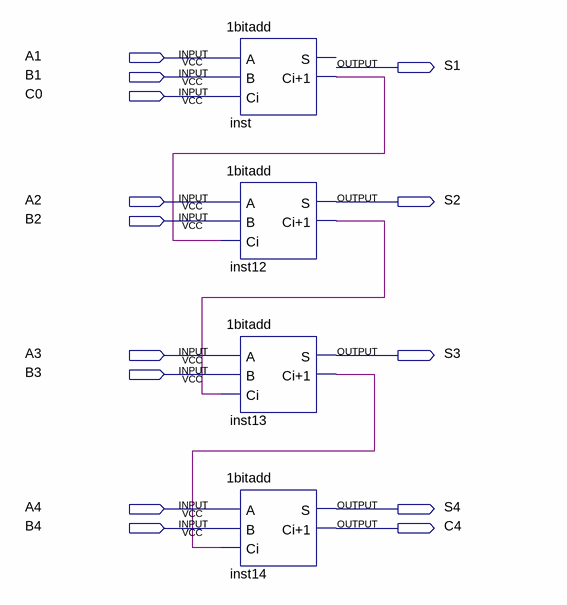
[diagram p0: schematic sheet]
// Quartus schematic 4bit.bdf as structural Verilog: 4 symbols, 14 pins
module \4bit  (
  input  A1,
  input  B1,
  input  C0,
  input  A2,
  input  B2,
  input  A3,
  input  B3,
  input  A4,
  input  B4,
  output S1,
  output S2,
  output S3,
  output S4,
  output C4
);

  wire inst12_ci_1, inst13_ci_1, inst_ci_1;

  \1bitadd  inst (.A(A1), .B(B1), .Ci(C0), .\Ci+1 (inst_ci_1));  // open: S
  \1bitadd  inst12 (.A(A2), .B(B2), .Ci(inst_ci_1), .S(S2), .\Ci+1 (inst12_ci_1));
  \1bitadd  inst13 (.A(A3), .B(B3), .Ci(inst12_ci_1), .S(S3), .\Ci+1 (inst13_ci_1));
  \1bitadd  inst14 (.A(A4), .B(B4), .Ci(inst13_ci_1), .S(S4), .\Ci+1 (C4));
endmodule
